# EAGLE design CNC Power (EAGLE 7.5.0)
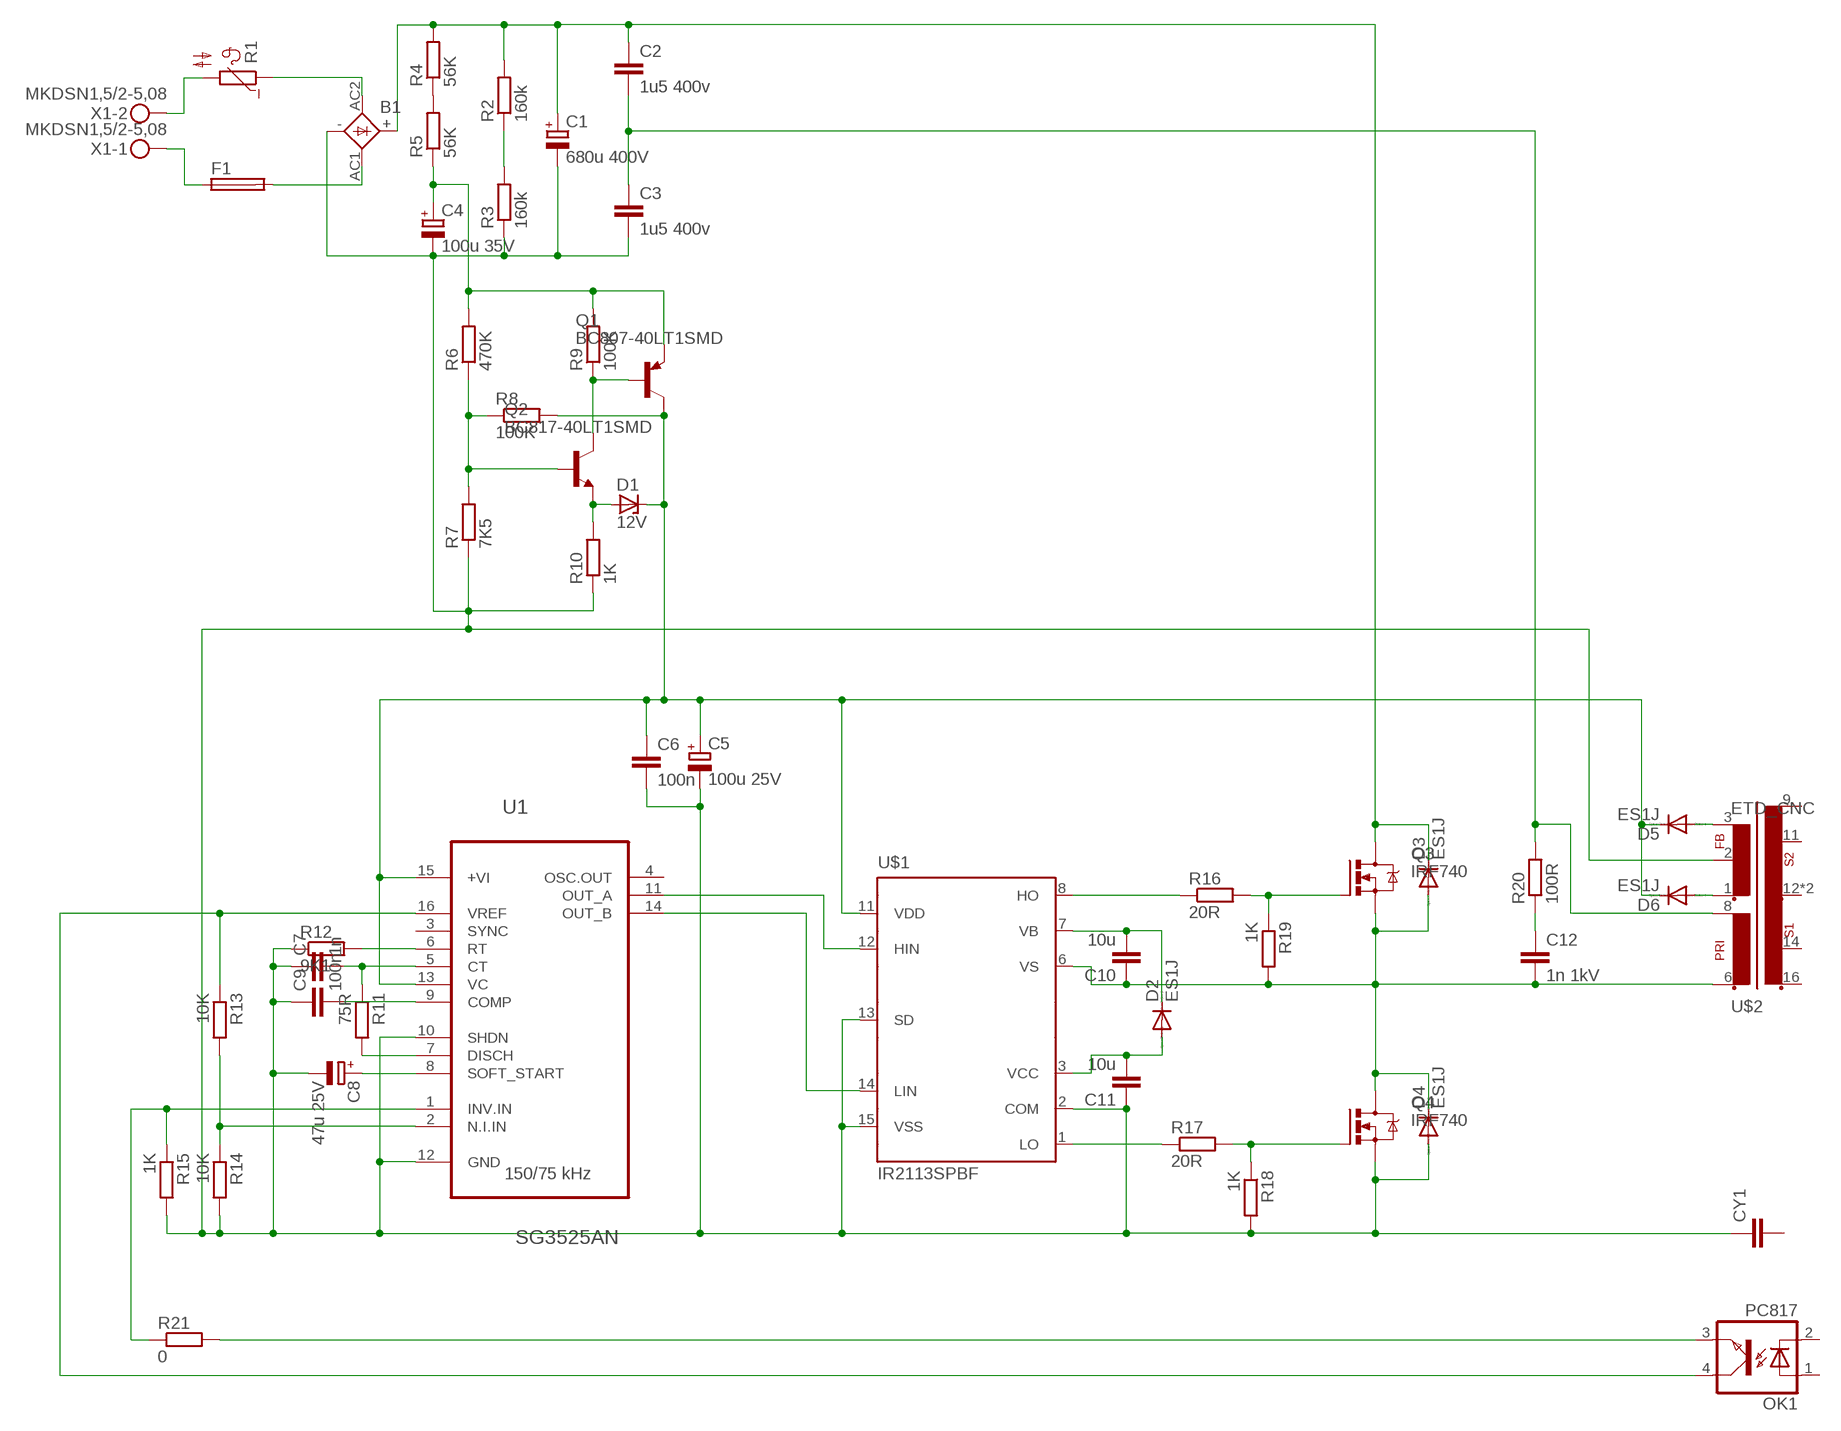
[diagram p0: schematic, sheet 1]

## Parts
B1  KBL  [KBL]
C1  680u 400V  CPOL-EUE10-35  [EB35D]
C2  1u5 400v  C-EU225-074X268  [C225-074X268]
C3  1u5 400v  C-EU225-074X268  [C225-074X268]
C4  100u 35V  CPOL-EUE2.5-7  [E2,5-7]
C5  100u 25V  CPOL-EUE2.5-7  [E2,5-7]
C6  100n  C-EUC0805  [C0805]
C7  1n  C-EUC0805  [C0805]
C8  47u 25V  CPOL-EUE2.5-7  [E2,5-7]
C9  100n  C-EUC0805  [C0805]
C10  10u  C-EUC0805  [C0805]
C11  10u  C-EUC0805  [C0805]
C12  1n 1kV  C-EU050-025X075  [C050-025X075]
CY1  CYYC10B4  [YC10B4]
D1  12V  ZENER-DIODESOD80C  [SOD80C]
D2  ES1J  DIODE-DO214AC  [DO214AC]
D3  ES1J  DIODE-DO214AC  [DO214AC]
D4  ES1J  DIODE-DO214AC  [DO214AC]
D5  ES1J  DIODE-DO214AC  [DO214AC]
D6  ES1J  DIODE-DO214AC  [DO214AC]
F1  SH22,5  [SH22,5]
OK1  PC817  [DIL04]
Q1  BC807-40LT1SMD  [SOT23-BEC]
Q2  BC817-40LT1SMD  [SOT23-BEC]
Q3  IRF740  [TO220BV]
Q4  IRF740  [TO220BV]
R1  B57164  [B57164]
R2  160k  R-EU_0207/10  [0207/10]
R3  160k  R-EU_0207/10  [0207/10]
R4  56K  R-EU_0617/17  [0617/17]
R5  56K  R-EU_0617/17  [0617/17]
R6  470K  R-EU_R0805  [R0805]
R7  7K5  R-EU_R0805  [R0805]
R8  100K  R-EU_R0805  [R0805]
R9  100K  R-EU_R0805  [R0805]
R10  1K  R-EU_R0805  [R0805]
R11  75R  R-EU_R0805  [R0805]
R12  9K1  R-EU_R0805  [R0805]
R13  10K  R-EU_R0805  [R0805]
R14  10K  R-EU_R0805  [R0805]
R15  1K  R-EU_R0805  [R0805]
R16  20R  R-EU_R1206  [R1206]
R17  20R  R-EU_R1206  [R1206]
R18  1K  R-EU_R0805  [R0805]
R19  1K  R-EU_R0805  [R0805]
R20  100R  R-EU_0617/17  [0617/17]
R21  0  R-EU_R1206  [R1206]
U1  SG3525AN  [DIP254P762X510-16]
U$1  IR2113SPBF  [SO16W]
U$2  ETD_CNC  [ETD39_16PIN]
X1  MKDSN1,5/2-5,08  [MKDSN1,5/2-5,08]

## Nets
12V: C5.+ C6.1 D1.C D5.C D6.C Q1.C R8.2 U1.13(VC) U1.15(+VI) U$1.11(VDD)
HV-0: B1.- C1.- C3.2 C4.- C5.- C6.2 C7.1 C8.- C9.1 C11.1 CY1.1 D4.A Q4.S R3.1 R7.1 R10.1 R12.1 R14.2 R15.2 R18.2 U1.10(SHDN) U1.12(GND) U$1.2(COM) U$1.13(SD) U$1.15(VSS) U$2.2(F0)
HV-150: C2.2 C3.1 R20.2 U$2.8(P-2)
HV-300: B1.+ C1.+ C2.1 D3.C Q3.D R2.2 R4.2
N$1: R1.2 X1.2
N$2: F1.1 X1.1
N$3: B1.AC1(AC2) F1.2
N$4: B1.AC2(AC1) R1.1
N$5: R16.1 U$1.8(HO)
N$6: R17.1 U$1.1(LO)
N$7: Q3.G R16.2 R19.1
N$8: R2.1 R3.2
N$9: R4.1 R5.2
N$10: C4.+ Q1.E R5.1 R6.2 R9.2
N$11: Q2.B R6.1 R7.2 R8.1
N$12: Q1.B Q2.C R9.1
N$13: OK1.3(EMIT) R21.2
N$14: D1.A Q2.E R10.2
N$15: C7.2 R11.1 U1.5(CT)
N$16: R11.2 U1.7(DISCH)
N$17: Q4.G R17.2 R18.1
N$18: U1.11(OUT_A) U$1.12(HIN)
N$19: U1.14(OUT_B) U$1.14(LIN)
N$20: R12.2 U1.6(RT)
N$21: C8.+ U1.8(SOFT_START)
N$22: C9.2 U1.9(COMP)
N$23: OK1.4(COL) R13.1 U1.16(VREF)
N$24: R13.2 R14.1 U1.2(N.I.IN)
N$25: R15.1 R21.1 U1.1(INV.IN)
N$28: D6.A U$2.1(F+12)
N$29: D5.A U$2.3(F-12)
N$30: C12.1 R20.1
VB: C10.2 D2.C U$1.7(VB)
VCC: C11.2 D2.A U$1.3(VCC)
VS: C10.1 C12.2 D3.A D4.C Q3.S Q4.D R19.2 U$1.6(VS) U$2.6(P-1)
Unconnected: CY1.2 OK1.1(A) OK1.2(C) U1.3(SYNC) U1.4(OSC.OUT) U$2.9(S-48) U$2.11(S-24) U$2.12(S-0) U$2.13(S-0) U$2.14(S1+24) U$2.16(S1+48)

## Notes on the sheet
- 150/75 kHz

## Library data of the parts
B1 = rectifier:KBL: DIOTEC RECTIFIER
C1 C4 C5 C8 = rcl:CPOL-EU: POLARIZED CAPACITOR, European symbol
C2 C3 C6 C7 C9-C12 = rcl:C-EU: CAPACITOR, European symbol
CY1 = rcl:CY: Y CAPACITOR for power line
D1 = diode:ZENER-DIODE: Z-Diode
D2-D6 = diode:DIODE-: DIODE
F1 = fuse:SH22,5: FUSE HOLDER grid 22,5 mm, OGN0031 8201, Schurter (Buerklin); MF: SCHURTER; MPN: 0031.8201; OC_FARNELL: 1162740; OC_NEWARK: 96F8317
OK1 = optocoupler:PC817: SHARP OPTO COUPLER; MPN: PC817X4J000F; OC_FARNELL: 9707727; OC_NEWARK: 97K7059
Q1 = transistor-pnp:BC807*: PNP Transistror
Q2 = transistor-npn:BC817*: NPN Transistor
Q3 Q4 = transistor-power:IRF740: N-CHANNEL MOS FET
R1 = ptc-ntc:B57164: SIEMENS NTC; MPN: B57164K474K52; OC_FARNELL: 9753451; OC_NEWARK: 29M3118
R2-R21 = rcl:R-EU_: RESISTOR, European symbol
U1 = ST Microelctronics_By_element14_Batch_1:SG3525AN: REGULATING PULSE WIDTH MODULATORS; MPN: SG3525AN; OC_FARNELL: 1564368; OC_NEWARK: 89K1506; PACKAGE: PDIP-16; SUPPLIER: STMICROELECTRONICS
U$1 = Namenlos:IR2113SPBF
U$2 = _Transformers:ETD_CNC
X1 = con-phoenix-508:MKDSN1,5/2-5,08: MKDSN 1,5/ 2-5,08 Printklemme Nennstrom: 13,5 A Nennspannung: 250 V Rastermaß: 5,08 mm Polzahl: 2 Anschlussart: Schraubanschluss Montage: Löten Anschlussrichtung Leiter/Platine: 0 ° Artikelnummer: 1729128 Source: http://eshop.phoenixcontact.com .. 1729128.pdf

## Board
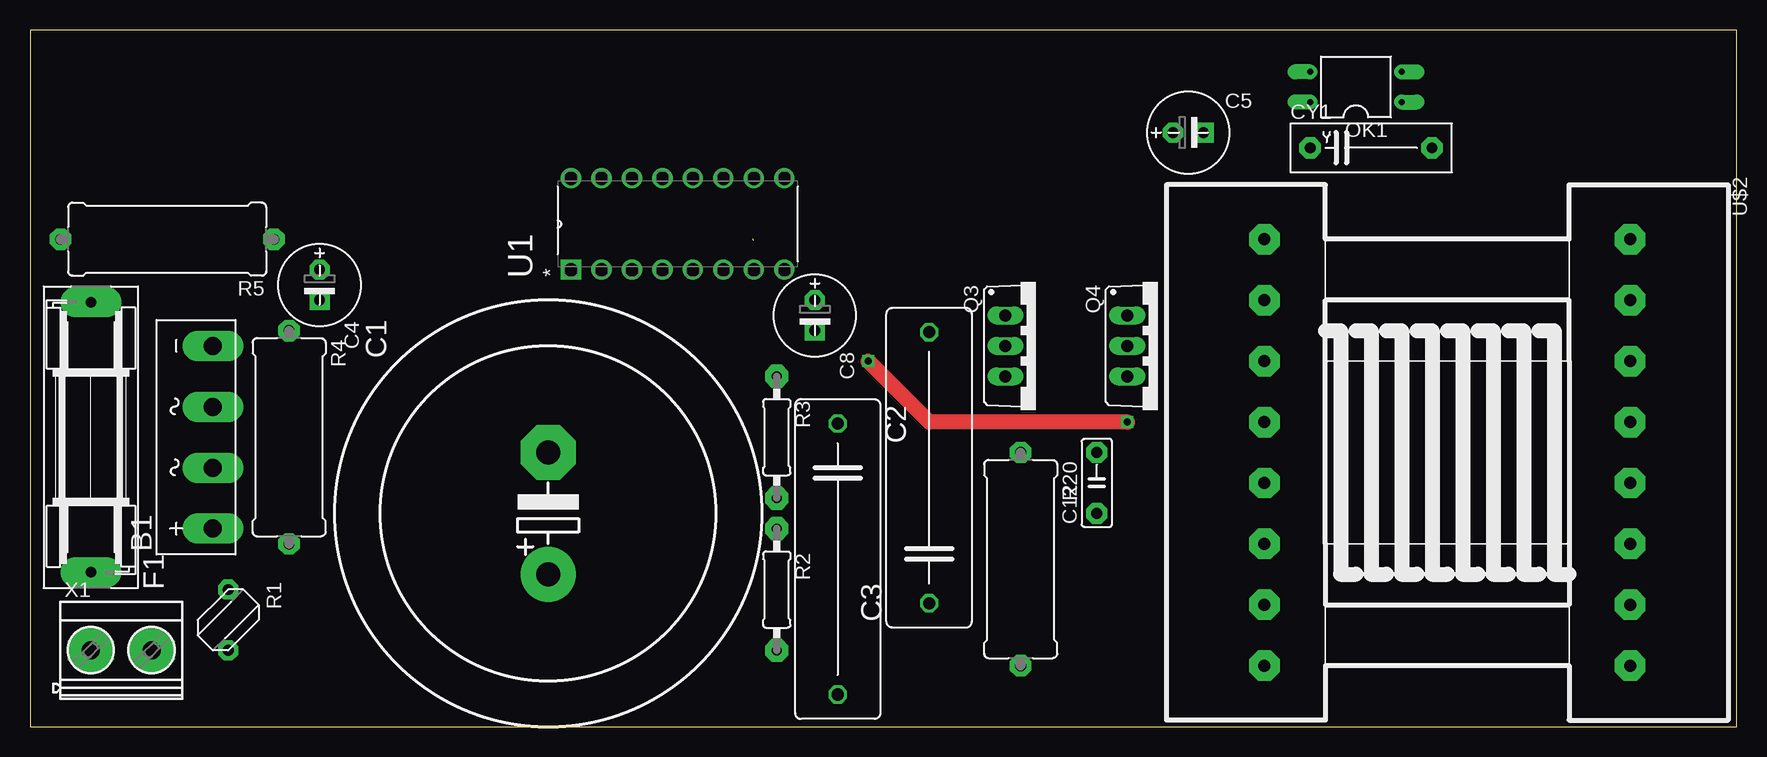
[diagram p1: board, top side]
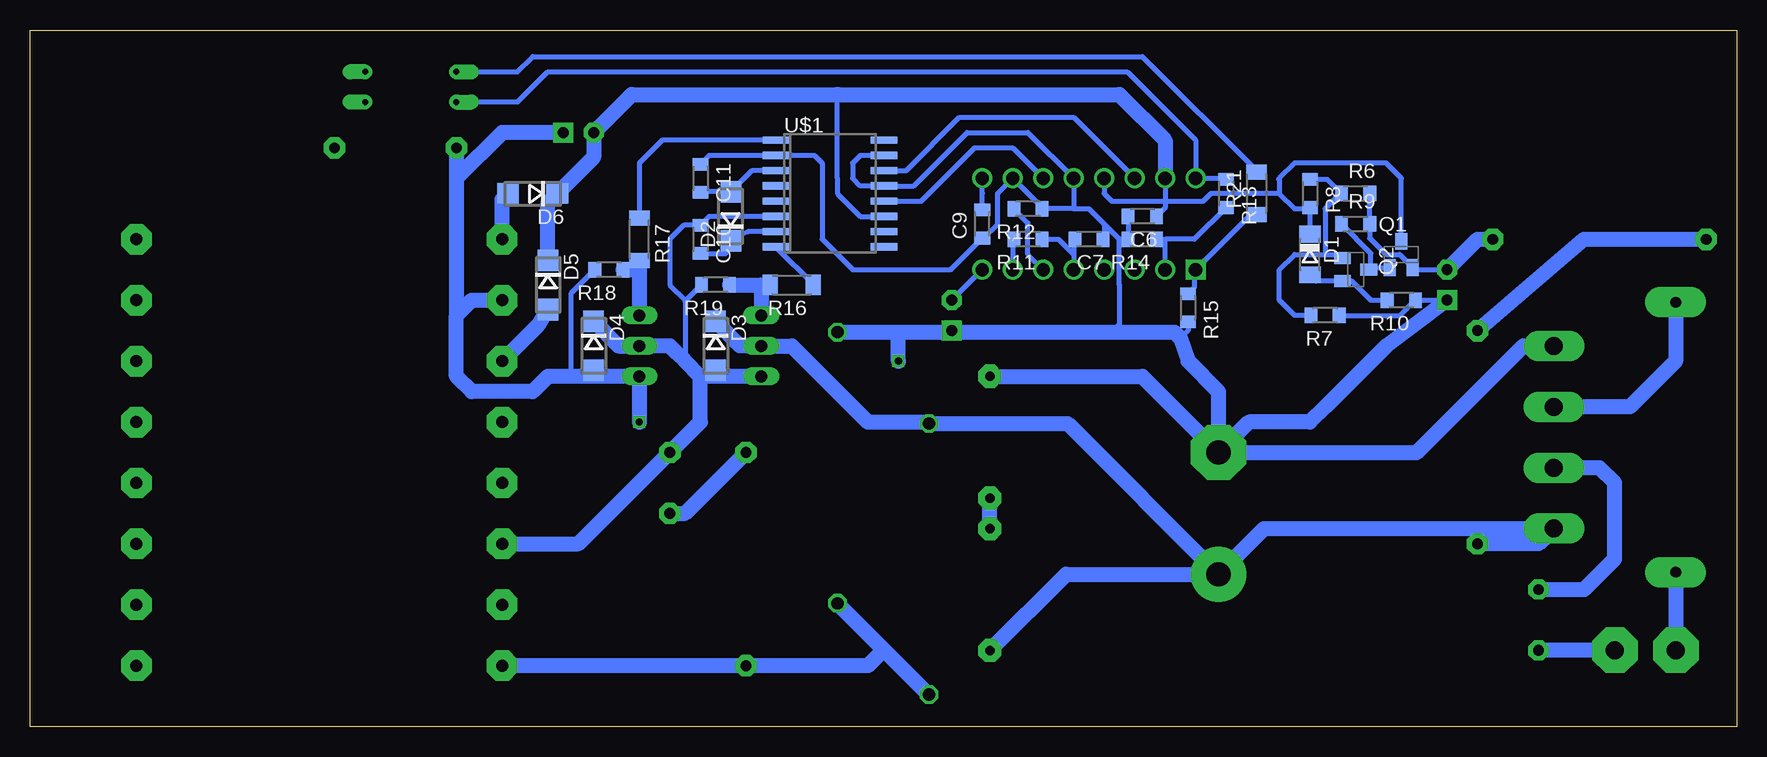
[diagram p2: board, bottom side, seen from below]

Size 142.22 x 58.09 mm. Coordinates in mm from the lower left corner, seen from the top.
Outline: 0,0 142.22,0 142.22,58.09 0,58.09 0,0
Copper layers (1*16): Top 0.035mm / dielectric 1.5mm / Bottom 0.035mm
Design rules "default": minimum track width 10mil, minimum drill 24mil, track to track 8mil, track to pad 8mil, pad to pad 8mil, via to via 8mil, smd to smd 8mil, copper to edge 40mil, drill to drill 8mil, minimum pad ring 10mil, minimum via ring 8mil, stop-mask expansion 4mil, vias tented up to drill 0mil, thermal gap 10mil

### Footprints (pad centres in the part's own frame; a part is rotated, then mirrored left to right if it is on the bottom)
KBL = drill 1.5 pad 2.54 long: + -7.62,-1.27; - 7.62,-1.27; AC1 2.54,-1.27; AC2 -2.54,-1.27
EB35D = drill 2.007 pad 4.597: + -5.08,0 | drill 2.007 pad 4.597 octagon: - 5.08,0
C225-074X268 = drill 1.016 octagon: 1 -11.303,0; 2 11.303,0
E2,5-7 = drill 0.9 pad 1.676 octagon: + -1.27,0 | drill 0.9 pad 1.676 square: - 1.27,0
C0805 = smd 1.05 x 1.3: 1 -1.175,0; 2 1.175,0
C050-025X075 = drill 0.9 pad 1.778 octagon: 1 -2.54,0; 2 2.54,0
YC10B4 = drill 0.9 pad 1.778 octagon: 1 -5.08,0; 2 5.08,0
SOD80C = smd 1.4 x 1.8: A 1.7,0; C -1.7,0
DO214AC = smd 1.8 x 1.7: A 2.05,0; C -2.05,0
SH22,5 = drill 0.9 pad 2.54 long: 1 -11.252,0; 2 11.252,0
DIL04 = drill 0.5 pad 1.27 offset: 1 -1.27,-3.81; 2 1.27,-3.81; 3 1.27,3.81; 4 -1.27,3.81
SOT23-BEC = smd 1 x 1.4: B -0.95,-1.1; C 0,1.1; E 0.95,-1.1
TO220BV = drill 1 pad 1.422 long: D 0,-2.54; G -2.54,-2.54; S 2.54,-2.54
B57164 = drill 0.9 pad 1.676 octagon: 1 -2.54,0; 2 2.54,0
0207/10 = drill 0.8 pad 1.93 octagon: 1 -5.08,0; 2 5.08,0
0617/17 = drill 0.9 pad 1.778 octagon: 1 -8.89,0; 2 8.89,0
R0805 = smd 1.05 x 1.3: 1 -1.175,0; 2 1.175,0
R1206 = smd 1.25 x 1.7: 1 -1.775,0; 2 1.775,0
DIP254P762X510-16 = drill 1.118 square: 1 -7.62,17.78 | drill 1.118: 2 -7.62,15.24; 3 -7.62,12.7; 4 -7.62,10.16; 5 -7.62,7.62; 6 -7.62,5.08; 7 -7.62,2.54; 8 -7.62,0; 9 0,0; 10 0,2.54; 11 0,5.08; 12 0,7.62; 13 0,10.16; 14 0,12.7; 15 0,15.24; 16 0,17.78
SO16W = smd 0.6 x 2.2: 1 -4.445,-4.505; 2 -3.175,-4.505; 3 -1.905,-4.505; 4 -0.635,-4.505; 5 0.635,-4.505; 6 1.905,-4.505; 7 3.175,-4.505; 8 4.445,-4.505; 9 4.445,4.505; 10 3.175,4.505; 11 1.905,4.505; 12 0.635,4.505; 13 -0.635,4.505; 14 -1.905,4.505; 15 -3.175,4.505; 16 -4.445,4.505
ETD39_16PIN = drill 1 pad 2.54 octagon: 1 -17.78,-15.24; 2 -12.7,-15.24; 3 -7.62,-15.24; 4 -2.54,-15.24; 5 2.54,-15.24; 6 7.62,-15.24; 7 12.7,-15.24; 8 17.78,-15.24; 9 17.78,15.24; 10 12.7,15.24; 11 7.62,15.24; 12 2.54,15.24; 13 -2.54,15.24; 14 -7.62,15.24; 15 -12.7,15.24; 16 -17.78,15.24
MKDSN1,5/2-5,08 = drill 1.5 pad 3.81 octagon: 1 -2.561,0.025; 2 2.519,0.025

### Placement (x,y rotation side)
B1  13.97,24.13 90 top
C1  43.18,17.78 90 top
C2  67.31,13.97 270 top
C3  74.93,21.59 90 top
C4  24.13,36.83 270 top
C5  96.52,49.53 0 top
C6  49.53,42.55 180 bottom
C7  53.98,40.64 180 bottom
C8  65.41,34.29 270 top
C9  62.87,41.91 90 bottom
C10  86.36,40.64 270 bottom
C11  86.36,45.72 270 bottom
C12  88.9,20.32 90 top
CY1  111.76,48.26 0 top
D1  35.56,39.37 270 bottom
D2  83.82,42.55 90 bottom
D3  85.09,31.75 270 bottom
D4  95.25,31.75 270 bottom
D5  99.06,36.83 270 bottom
D6  100.33,44.45 180 bottom
F1  5.08,24.13 90 top
OK1  110.49,53.34 90 top
Q1  27.94,39.37 0 bottom
Q2  31.75,38.1 270 bottom
Q3  83.82,31.75 270 top
Q4  93.98,31.75 270 top
R1  16.51,8.89 270 top
R2  62.23,11.43 270 top
R3  62.23,24.13 270 top
R4  21.59,24.13 270 top
R5  11.43,40.64 180 top
R6  31.75,44.45 0 bottom
R7  34.29,34.29 180 bottom
R8  35.56,44.45 270 bottom
R9  31.75,41.91 0 bottom
R10  27.94,35.56 180 bottom
R11  59.05,40.64 180 bottom
R12  59.05,43.18 180 bottom
R13  42.55,44.45 270 bottom
R14  49.53,40.64 180 bottom
R15  45.72,34.92 270 bottom
R16  78.74,36.83 180 bottom
R17  91.44,40.64 270 bottom
R18  93.98,38.1 180 bottom
R19  85.09,36.83 180 bottom
R20  82.55,13.97 270 top
R21  40.01,44.45 90 bottom
U1  62.87,45.72 90 top
U$1  75.56,44.45 270 bottom
U$2  118.11,22.86 270 top
X1  7.62,6.35 0 top

### Tracks (layer width: path | path; a pad name or v marks a point on that pad's centre or on a via)
12V
  Bottom 0.406: D1.C R8.2 35.66,43.18 36.83,43.18 38.1,44.45 | U1.13 52.7,44.45 52.07,43.81 47.62,43.81 | 47.62,43.81 44.45,43.81 43.81,44.45 41.27,44.45 38.1,44.45 | Q1.C 27.94,45.72 29.21,46.99 36.83,46.99 38.1,45.72 | 38.1,45.72 38.1,44.45 | U1.15 47.62,43.81 | 38.2,45.62 38.1,45.72 | 47.62,43.81 47.62,43.27 C6.1 | U$1.11 71.75,42.55 73.03,42.55 74.93,44.45 74.93,45.72 74.93,49.53 74.93,52.7
  Bottom 1.27: D5.C 99.06,43.67 98.67,44.06 | 98.67,44.06 D6.C | 98.67,44.06 95.25,47.48 C5.+ 92.08,52.7 74.93,52.7 51.44,52.7 47.62,48.9 U1.15
HV-0  (via drill 0.6)
  Top 1.27: v91.44,25.4 74.93,25.4 v69.85,30.48
  Bottom 0.406: C4.- R10.1 28.04,34.29 R7.1 | 55.24,43.18 53.98,43.18 52.7,41.91 | 52.7,41.91 52.7,40.73 | 52.7,40.73 C7.1 52.7,40.73 | 51.44,40.64 R14.2 C6.2 | 51.44,40.64 52.7,41.91 | 51.44,40.64 51.44,36.83 51.44,33.53 52.07,32.89 | 55.24,43.18 R12.1 57.88,43.27 U1.10 61.59,44.45 61.59,41.91 62.77,40.73 C9.1 65.5,38.1 73.66,38.1 76.2,40.64 76.2,46.99 76.83,47.62 U$1.2 85.63,47.62 C11.1 | R18.2 97.16,36.1 97.16,29.21 | 55.24,43.18 U1.12 59.05,49.53 64.14,49.53 68.58,45.09 U$1.13 | C8.- 65.91,33.02 66.04,32.89 | R15.2 45.72,33.02 46.35,32.38 | U$1.13 70.48,45.09 | 70.48,47.62 U$1.15 73.03,47.62 73.66,46.99 73.66,45.72 73.03,45.09 U$1.13
  Bottom 1.27: C1.- 26.67,22.86 17.78,31.75 B1.- | C4.- 29.21,31.75 34.29,26.67 35.56,25.4 40.64,25.4 C1.- | R3.1 49.53,29.21 C1.- | C3.2 69.85,32.89 | 69.85,32.89 66.04,32.89 52.07,32.89 49.53,32.89 46.86,32.89 46.35,32.38 45.72,30.48 43.18,27.94 C1.- | 95.25,29.21 Q4.S v91.44,25.4 | 95.25,29.21 97.16,29.21 99.06,29.21 100.33,27.94 105.41,27.94 106.68,29.21 106.68,34.29 | 106.68,34.29 105.41,35.56 U$2.2 | v69.85,30.48 69.85,32.89 | D4.A 95.25,29.21 | CY1.1 106.68,45.72 | 106.68,45.72 106.68,43.18 106.68,34.29 | C5.- 102.87,49.53 106.68,45.72
HV-150
  Bottom 1.27: C2.2 71.06,6.41 | 71.06,6.41 C3.1 | 71.06,6.41 72.39,5.08 R20.2 U$2.8
HV-300
  Bottom 1.27: R4.2 16.51,15.24 B1.+ 39.37,16.51 C1.+ | R2.2 55.88,12.7 C1.+ | C1.+ 55.75,25.27 C2.1 67.44,25.4 72.39,25.4 78.74,31.75 Q3.D 83.04,31.75 D3.C
N$1
  Bottom 1.27: X1.2 16.51,6.38 R1.2
N$2
  Bottom 1.27: F1.1 5.06,12.88 X1.1
N$3
  Bottom 1.27: F1.2 5.08,30.48 8.89,26.67 B1.AC1
N$4
  Bottom 1.27: R1.1 12.7,11.43 10.16,13.97 10.16,20.32 11.43,21.59 B1.AC2
N$5
  Bottom 0.406: U$1.8 76.97,36.9 R16.1
N$6
  Bottom 0.406: U$1.1 89.53,48.9 91.44,46.99 R17.1
N$7
  Bottom 0.406: 83.82,36.83 R19.1 | R16.2 81.28,36.83
  Bottom 1.27: Q3.G 81.28,36.83 83.82,36.83 R19.1
N$8
  Bottom 1.27: R2.1 R3.2
N$9
  Bottom 1.27: R4.1 12.7,40.64 R5.2
N$10
  Bottom 0.406: 24.23,38.2 C4.+ 26.82,38.1 Q1.E 28.09,39.37 29.21,39.37 30.57,40.73 R9.2 R6.2
  Bottom 1.27: C4.+ 21.59,40.64 R5.1
N$11
  Bottom 0.406: 32.7,39.05 Q2.B 33.17,39.37 34.29,39.37 | R7.2 36.83,34.29 38.1,35.56 38.1,38.1 36.83,39.37 34.29,39.37 | R8.1 34.1,45.62 R6.1 33.02,44.45 34.29,43.18 34.29,39.37
N$12
  Bottom 0.406: 30.48,38.27 Q2.C 30.48,38.27 | 30.48,38.27 Q1.B | 30.48,38.27 30.48,39.47 R9.1
N$13
  Bottom 0.406: OK1.3 101.6,54.61 100.33,55.88 49.53,55.88 40.01,46.35 R21.2
N$14
  Bottom 0.406: R10.2 30.48,35.56 31.75,36.83 32.07,37.15 Q2.E 33.34,37.15 35.04,37.15 D1.A
N$15
  Bottom 0.406: R11.1 56.52,40.64 55.24,39.37 U1.5 55.24,40.55 C7.2
N$16  (1 unrouted)
  Bottom 0.406: 60.33,40.55 U1.7
N$17
  Bottom 1.27: R17.2 91.44,38.1 | 91.44,38.1 Q4.G | R18.1 91.44,38.1
N$18
  Bottom 0.406: U$1.12 67.94,43.81 63.5,48.26 60.33,48.26 U1.11
N$19
  Bottom 0.406: U$1.14 69.22,46.35 64.77,50.8 55.24,50.8 U1.14
N$20
  Bottom 0.406: U1.6 59.05,39.37 59.05,42.01 R12.2 60.23,43.09
N$21
  Bottom 0.406: U1.8 C8.+
N$22
  Bottom 0.406: C9.2 62.87,44.45 U1.9
N$23
  Bottom 0.406: R13.1 42.64,45.72 U1.16 45.09,48.9 50.8,54.61 99.06,54.61 101.6,52.07 OK1.4
N$24
  Bottom 0.406: R14.1 47.62,40.64 | U1.2 47.62,40.64 | R13.2 45.18,40.64 47.62,40.64
N$25
  Bottom 0.406: R21.1 40.51,42.67 U1.1 45.18,38.01 45.18,36.64 R15.1
N$28
  Bottom 1.27: U$2.1 102.87,43.96 D6.A
N$29
  Bottom 1.27: U$2.3 99.84,33.51 D5.A
N$30
  Bottom 1.27: C12.1 87.63,17.78 R20.1
VB
  Bottom 0.406: U$1.7 82.41,41.27 D2.C 84.22,39.47 C10.2
VCC
  Bottom 0.406: U$1.3 82.06,46.35 D2.A 86.31,44.59 C11.2
VS
  Bottom 0.406: R19.2 87.58,35.51 | 87.58,35.51 87.63,35.47 87.63,30.48 | U$1.6 85.63,42.55 C10.1 87.72,41.81 88.9,40.64 88.9,36.83 87.58,35.51
  Bottom 1.27: U$2.6 96.52,15.24 C12.2 86.36,25.4 86.36,29.21 | Q3.S 85.09,29.21 | 85.09,29.21 86.36,29.21 | 86.36,29.21 87.63,30.48 88.27,31.11 88.9,31.75 Q4.D 93.2,31.75 D4.C | D3.A 85.09,29.21